# Altium schematic sheet Mynd_Main.SchDoc: Mynd-Main
size A3; PageSetup: Record=PageOptions|CenterHorizontal=True|CenterVertical=True|PrintScale=0.70|XCorrection=1.00|YCorrection=1.00|PrintKind=0|BorderSize=5000000|LeftOffset=0|BottomOffset=0|Orientation=2|PaperLength=1000|PaperWidth=1000|Scale=100|PaperSource=7|PrintQuality=-4|MediaType=1|DitherType=10|PaperKind=A4|PrintScaleMode=1; ApprovedBy: Jianhua.Zhong; CheckedBy: Aileen.zheng; DrawnBy: GuoHui.Lin; Revision: 3.3; SheetNumber: 1; SheetTotal: 6; Model NO.: PS2307; ISSUE DATE: 20230810; REV DATE: 20240117; PCB_Rev: 3.3; ASM_Rev: 3.3
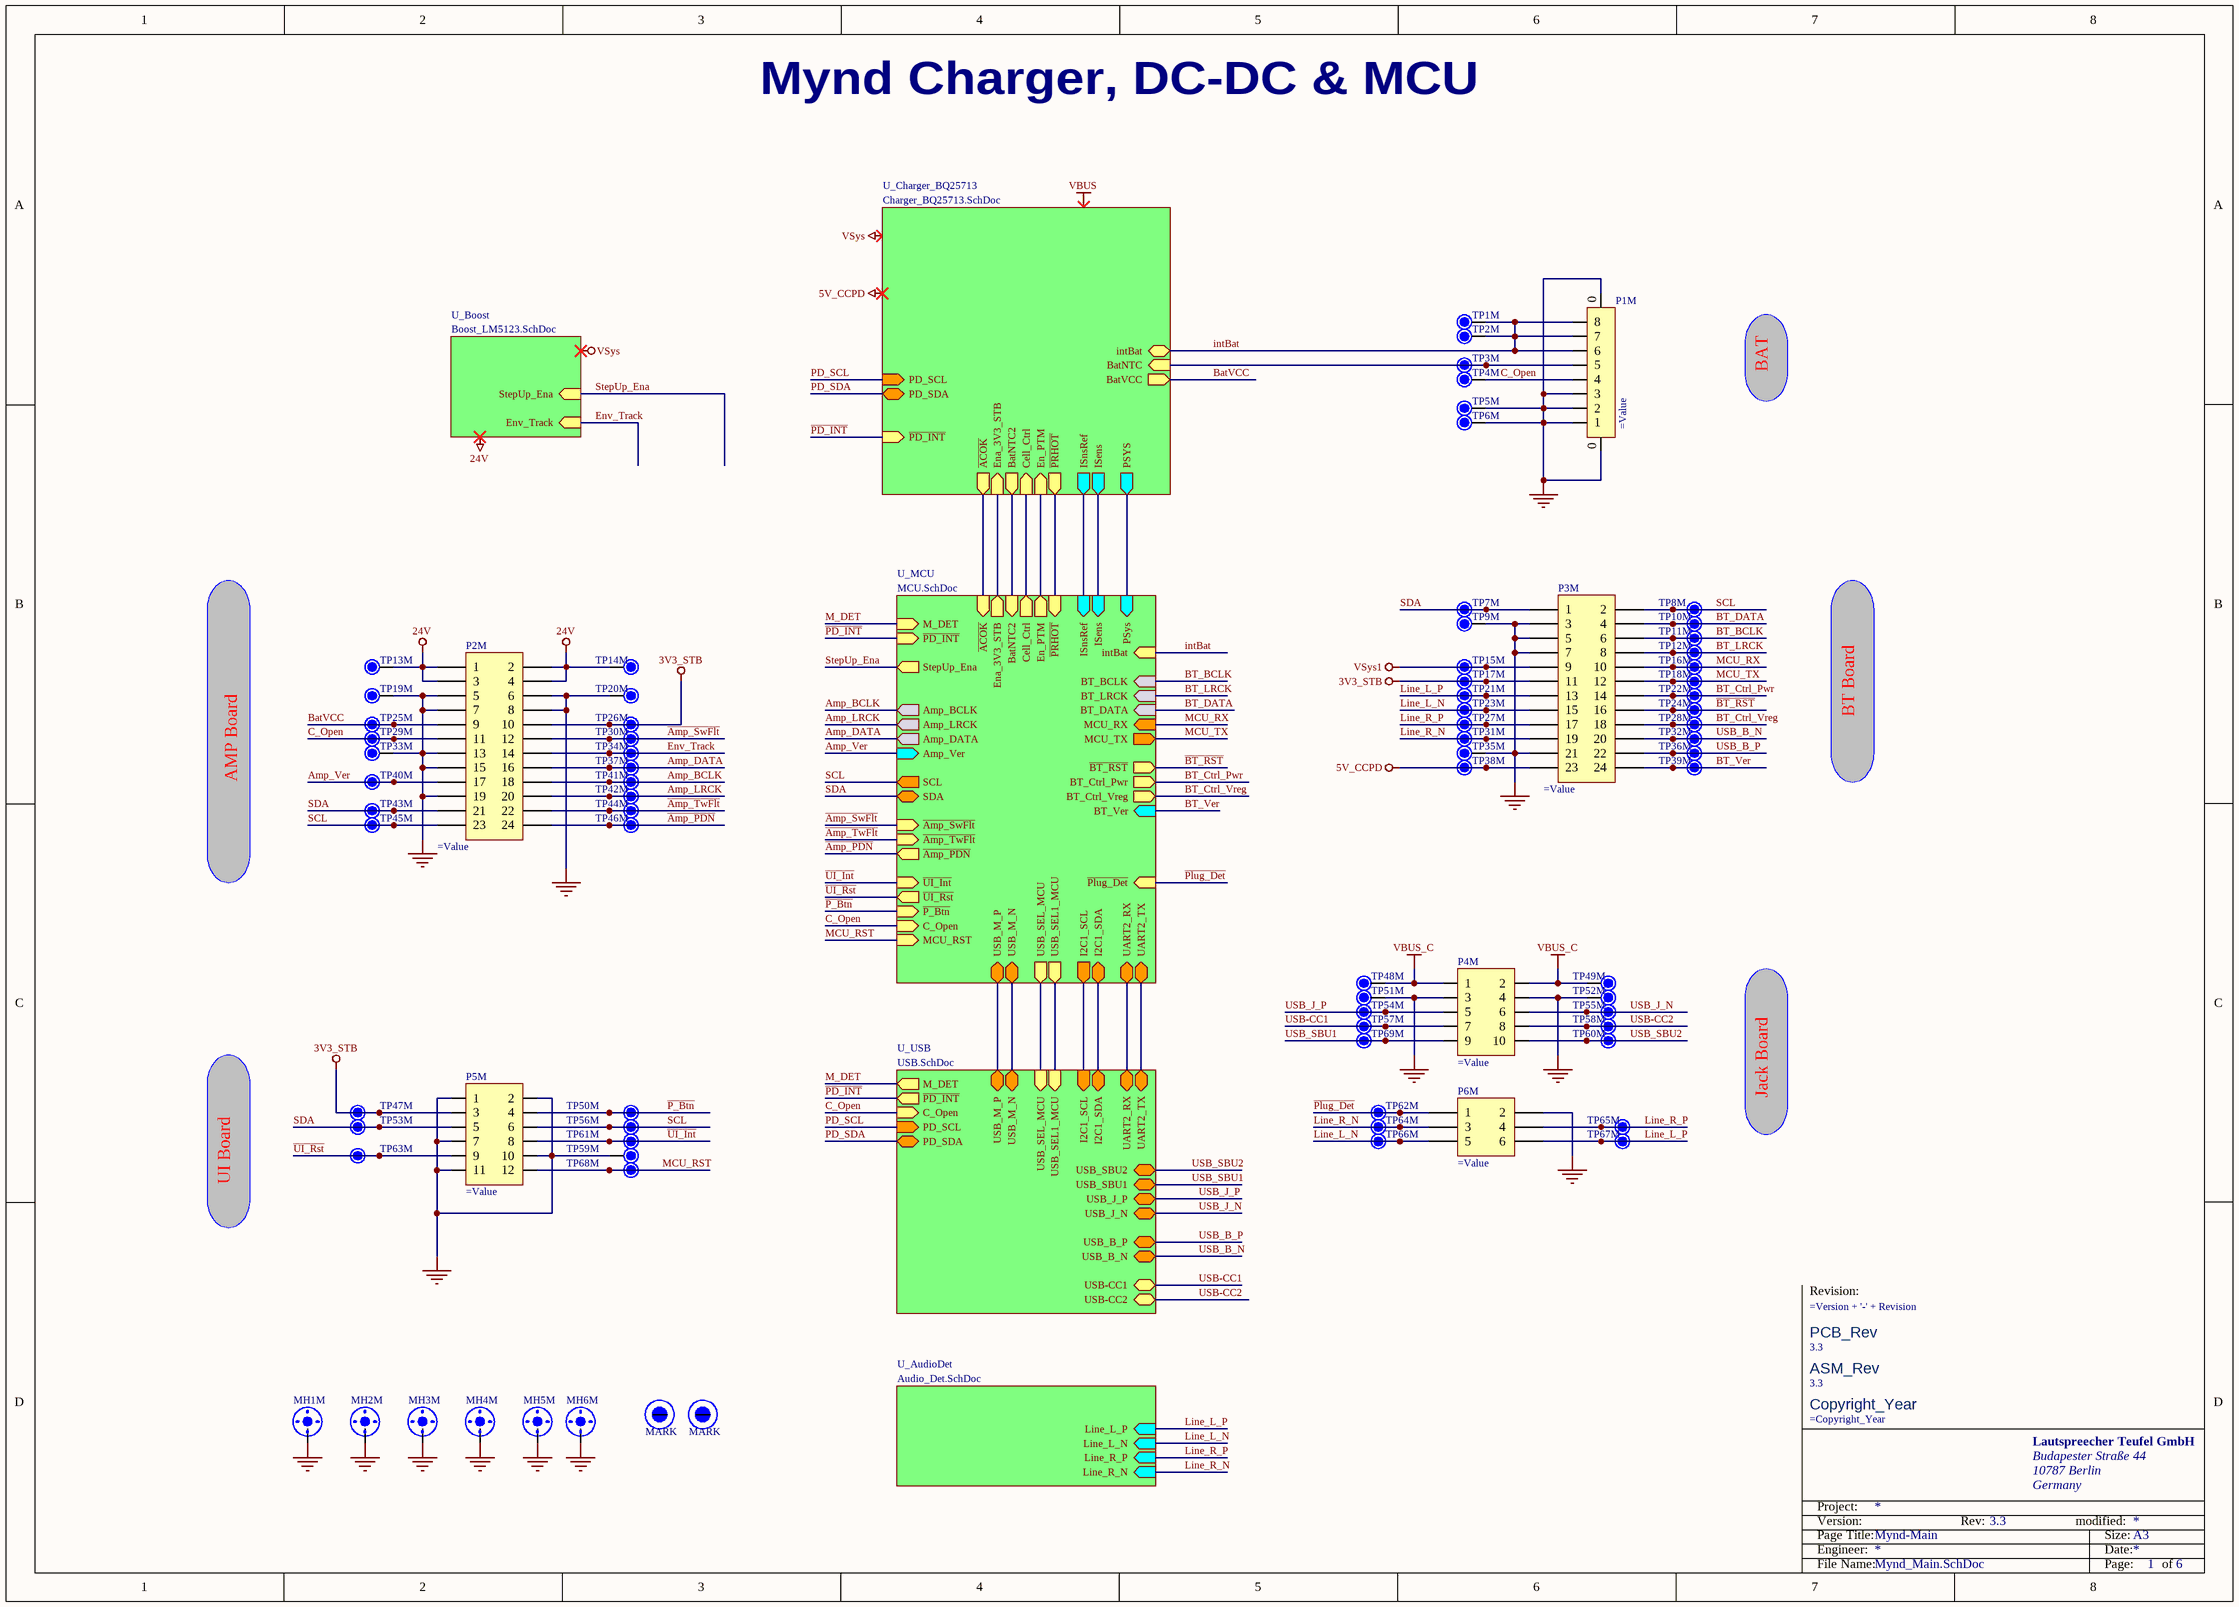
[diagram p0: Mynd_Main.SchDoc]

## Parts
MH1M  SCREW_HOLE_D30  [SCREW_D30]  (value not drawn)  (no BOM)
MH2M  SCREW_HOLE_D30  [SCREW_D30]  (value not drawn)  (no BOM)
MH3M  SCREW_HOLE_D30  [SCREW_D30]  (value not drawn)  (no BOM)
MH4M  SCREW_HOLE_D30  [SCREW_D30]  (value not drawn)  (no BOM)
MH5M  SCREW_HOLE_D30  [SCREW_D30]  (value not drawn)  (no BOM)
MH6M  SCREW_HOLE_D30  [SCREW_D30]  (value not drawn)  (no BOM)
MK1M  MARK  [MARK]  (no BOM)
MK2M  MARK  [MARK]  (no BOM)
P1M  (no value)  [CON_250_SMD_H_8P]
P2M  (no value)  [Female_SMD_Bottom_2X12_254]
P3M  (no value)  [Female_SMD_Bottom_2X12_254]
P4M  (no value)  [WB200AL_2x5P]
P5M  (no value)  [WB200AL_2x6P]
P6M  (no value)  [WB200AL_2x3P]
Teufel_ASM_Label1M  3.3  [Teufel_ASM_Rev]  (no BOM)
Teufel_Copyright1M  (no value)  [TEUFEL_COPYRIGHT]  (no BOM)
Teufel_PCB_Label1M  3.3  [Teufel_PCB_Rev]  (no BOM)
Teufel_PCB_Logo1M  (no value)  [Teufel_NoLogo]  (no BOM)
TP1M  TP12  [TP120]  (value not drawn)  (no BOM)
TP2M  TP12  [TP120]  (value not drawn)  (no BOM)
TP3M  TP12  [TP120]  (value not drawn)  (no BOM)
TP4M  TP12  [TP120]  (value not drawn)  (no BOM)
TP5M  TP12  [TP120]  (value not drawn)  (no BOM)
TP6M  TP12  [TP120]  (value not drawn)  (no BOM)
TP7M  TP12  [TP120]  (value not drawn)  (no BOM)
TP8M  TP12  [TP120]  (value not drawn)  (no BOM)
TP9M  TP12  [TP120]  (value not drawn)  (no BOM)
TP10M  TP12  [TP120]  (value not drawn)  (no BOM)
TP11M  TP12  [TP120]  (value not drawn)  (no BOM)
TP12M  TP12  [TP120]  (value not drawn)  (no BOM)
TP13M  TP12  [TP120]  (value not drawn)  (no BOM)
TP14M  TP12  [TP120]  (value not drawn)  (no BOM)
TP15M  TP12  [TP120]  (value not drawn)  (no BOM)
TP16M  TP12  [TP120]  (value not drawn)  (no BOM)
TP17M  TP12  [TP120]  (value not drawn)  (no BOM)
TP18M  TP12  [TP120]  (value not drawn)  (no BOM)
TP19M  TP12  [TP120]  (value not drawn)  (no BOM)
TP20M  TP12  [TP120]  (value not drawn)  (no BOM)
TP21M  TP12  [TP120]  (value not drawn)  (no BOM)
TP22M  TP12  [TP120]  (value not drawn)  (no BOM)
TP23M  TP12  [TP120]  (value not drawn)  (no BOM)
TP24M  TP12  [TP120]  (value not drawn)  (no BOM)
TP25M  TP12  [TP120]  (value not drawn)  (no BOM)
TP26M  TP12  [TP120]  (value not drawn)  (no BOM)
TP27M  TP12  [TP120]  (value not drawn)  (no BOM)
TP28M  TP12  [TP120]  (value not drawn)  (no BOM)
TP29M  TP12  [TP120]  (value not drawn)  (no BOM)
TP30M  TP12  [TP120]  (value not drawn)  (no BOM)
TP31M  TP12  [TP120]  (value not drawn)  (no BOM)
TP32M  TP12  [TP120]  (value not drawn)  (no BOM)
TP33M  TP12  [TP120]  (value not drawn)  (no BOM)
TP34M  TP12  [TP120]  (value not drawn)  (no BOM)
TP35M  TP12  [TP120]  (value not drawn)  (no BOM)
TP36M  TP12  [TP120]  (value not drawn)  (no BOM)
TP37M  TP12  [TP120]  (value not drawn)  (no BOM)
TP38M  TP12  [TP120]  (value not drawn)  (no BOM)
TP39M  TP12  [TP120]  (value not drawn)  (no BOM)
TP40M  TP12  [TP120]  (value not drawn)  (no BOM)
TP41M  TP12  [TP120]  (value not drawn)  (no BOM)
TP42M  TP12  [TP120]  (value not drawn)  (no BOM)
TP43M  TP12  [TP120]  (value not drawn)  (no BOM)
TP44M  TP12  [TP120]  (value not drawn)  (no BOM)
TP45M  TP12  [TP120]  (value not drawn)  (no BOM)
TP46M  TP12  [TP120]  (value not drawn)  (no BOM)
TP47M  TP12  [TP120]  (value not drawn)  (no BOM)
TP48M  TP12  [TP120]  (value not drawn)  (no BOM)
TP49M  TP12  [TP120]  (value not drawn)  (no BOM)
TP50M  TP12  [TP120]  (value not drawn)  (no BOM)
TP51M  TP12  [TP120]  (value not drawn)  (no BOM)
TP52M  TP12  [TP120]  (value not drawn)  (no BOM)
TP53M  TP12  [TP120]  (value not drawn)  (no BOM)
TP54M  TP12  [TP120]  (value not drawn)  (no BOM)
TP55M  TP12  [TP120]  (value not drawn)  (no BOM)
TP56M  TP12  [TP120]  (value not drawn)  (no BOM)
TP57M  TP12  [TP120]  (value not drawn)  (no BOM)
TP58M  TP12  [TP120]  (value not drawn)  (no BOM)
TP59M  TP12  [TP120]  (value not drawn)  (no BOM)
TP60M  TP12  [TP120]  (value not drawn)  (no BOM)
TP61M  TP12  [TP120]  (value not drawn)  (no BOM)
TP62M  TP12  [TP120]  (value not drawn)  (no BOM)
TP63M  TP12  [TP120]  (value not drawn)  (no BOM)
TP64M  TP12  [TP120]  (value not drawn)  (no BOM)
TP65M  TP12  [TP120]  (value not drawn)  (no BOM)
TP66M  TP12  [TP120]  (value not drawn)  (no BOM)
TP67M  TP12  [TP120]  (value not drawn)  (no BOM)
TP68M  TP12  [TP120]  (value not drawn)  (no BOM)
TP69M  TP12  [TP120]  (value not drawn)  (no BOM)

## Sub-sheets
U_AudioDet = Audio_Det.SchDoc: Line_L_P (in), Line_L_N (in), Line_R_P (in), Line_R_N (in)
U_Boost = Boost_LM5123.SchDoc: Env_Track (in), StepUp_Ena (in)
U_Charger_BQ25713 = Charger_BQ25713.SchDoc: intBat (bidir), ISens (out), ISnsRef (out), Ena_3V3_STB (in), En_PTM (in), Cell_Ctrl (in), ~{PD_INT} (in), BatNTC (in), BatNTC2 (out), PD_SCL (in), PD_SDA (bidir), ~{ACOK} (out), ~{PRHOT} (out), PSYS (out), BatVCC (out)
U_MCU = MCU.SchDoc: ~{ACOK} (in), En_PTM (out), ~{PRHOT} (in), ISnsRef (in), ISens (in), StepUp_Ena (out), ~{Amp_PDN} (out), ~{Amp_TwFlt} (in), Amp_DATA (out), Amp_LRCK (out), Amp_BCLK (out), MCU_RX (in), MCU_TX (out), ~{BT_RST} (out), BT_Ctrl_Pwr (out), BT_Ctrl_Vreg (out), ~{Plug_Det} (in), ~{UI_Int} (in), ~{UI_Rst} (out), ~{P_Btn} (in), ~{PD_INT} (in), SCL (out), SDA (bidir), Ena_3V3_STB (out), I2C1_SCL (out), I2C1_SDA (bidir), USB_M_P (bidir), USB_SEL_MCU (out), USB_M_N (bidir), C_Open (in), Cell_Ctrl (out), ~{Amp_SwFlt} (in), BT_DATA (in), BT_LRCK (in), BT_BCLK (in), BatNTC2 (in), BT_Ver (in), Amp_Ver (in), M_DET (in), PSys (in), MCU_RST (in), USB_SEL1_MCU (out), UART2_RX (bidir), UART2_TX (bidir), intBat (in)
U_USB = USB.SchDoc: I2C1_SCL (in), ~{PD_INT} (out), I2C1_SDA (bidir), USB-CC1 (bidir), USB-CC2 (bidir), USB_J_P (bidir), USB_M_N (bidir), USB_B_N (bidir), USB_J_N (bidir), USB_M_P (bidir), USB_B_P (bidir), USB_SEL_MCU (in), PD_SCL (in), PD_SDA (bidir), M_DET (out), C_Open (in), USB_SEL1_MCU (in), USB_SBU1 (bidir), USB_SBU2 (bidir), UART2_RX (bidir), UART2_TX (bidir)

## Nets
3V3_STB: P2M.10 P3M.11 P5M.3 TP17M.1 TP26M.1 TP47M.1
5V_CCPD: P3M.23 TP38M.1
24V: P2M.1 P2M.2 P2M.3 P2M.4 TP13M.1 TP14M.1
GND: MH1M.1 MH2M.1 MH3M.1 MH4M.1 MH5M.1 MH6M.1 P1M.0 P1M.1 P1M.2 P1M.3 P2M.5 P2M.6 P2M.7 P2M.8 P2M.13 P2M.15 P2M.19 P3M.3 P3M.5 P3M.7 P3M.21 P4M.3 P4M.4 P5M.1 P5M.2 P5M.7 P5M.10 P5M.11 P6M.2 TP5M.1 TP6M.1 TP9M.1 TP19M.1 TP20M.1 TP33M.1 TP35M.1 TP51M.1 TP52M.1 TP59M.1
VBUS_C: P4M.1 P4M.2 TP48M.1 TP49M.1
VSys1: P3M.9 TP15M.1
~{BT_RST}: P3M.16 TP24M.1 ; sheet U_MCU/~{BT_RST}
~{P_Btn}: P5M.4 TP50M.1 ; sheet U_MCU/~{P_Btn}
~{PD_INT}: sheet U_USB/~{PD_INT}, sheet U_MCU/~{PD_INT}, sheet U_Charger_BQ25713/~{PD_INT}
~{Plug_Det}: P6M.1 TP62M.1 ; sheet U_MCU/~{Plug_Det}
~{UI_Int}: P5M.8 TP61M.1 ; sheet U_MCU/~{UI_Int}
~{UI_Rst}: P5M.9 TP63M.1 ; sheet U_MCU/~{UI_Rst}
~{Amp_PDN}: P2M.24 TP46M.1 ; sheet U_MCU/~{Amp_PDN}
~{Amp_SwFlt}: P2M.12 TP30M.1 ; sheet U_MCU/~{Amp_SwFlt}
~{Amp_TwFlt}: P2M.22 TP44M.1 ; sheet U_MCU/~{Amp_TwFlt}
Amp_BCLK: P2M.18 TP41M.1 ; sheet U_MCU/Amp_BCLK
Amp_DATA: P2M.16 TP37M.1 ; sheet U_MCU/Amp_DATA
Amp_LRCK: P2M.20 TP42M.1 ; sheet U_MCU/Amp_LRCK
Amp_Ver: P2M.17 TP40M.1 ; sheet U_MCU/Amp_Ver
BatVCC: P2M.9 TP25M.1 ; sheet U_Charger_BQ25713/BatVCC
BT_BCLK: P3M.6 TP11M.1 ; sheet U_MCU/BT_BCLK
BT_Ctrl_Pwr: P3M.14 TP22M.1 ; sheet U_MCU/BT_Ctrl_Pwr
BT_Ctrl_Vreg: P3M.18 TP28M.1 ; sheet U_MCU/BT_Ctrl_Vreg
BT_DATA: P3M.4 TP10M.1 ; sheet U_MCU/BT_DATA
BT_LRCK: P3M.8 TP12M.1 ; sheet U_MCU/BT_LRCK
BT_Ver: P3M.24 TP39M.1 ; sheet U_MCU/BT_Ver
C_Open: P1M.4 P2M.11 TP4M.1 TP29M.1 ; sheet U_USB/C_Open, sheet U_MCU/C_Open
Env_Track: P2M.14 TP34M.1 ; sheet U_Boost/Env_Track
intBat: P1M.6 P1M.7 P1M.8 TP1M.1 TP2M.1 ; sheet U_MCU/intBat, sheet U_Charger_BQ25713/intBat
Line_L_N: P3M.15 P6M.5 TP23M.1 TP66M.1 ; sheet U_AudioDet/Line_L_N
Line_L_P: P3M.13 P6M.6 TP21M.1 TP67M.1 ; sheet U_AudioDet/Line_L_P
Line_R_N: P3M.19 P6M.3 TP31M.1 TP64M.1 ; sheet U_AudioDet/Line_R_N
Line_R_P: P3M.17 P6M.4 TP27M.1 TP65M.1 ; sheet U_AudioDet/Line_R_P
M_DET: sheet U_USB/M_DET, sheet U_MCU/M_DET
MCU_RST: P5M.12 TP68M.1 ; sheet U_MCU/MCU_RST
MCU_RX: P3M.10 TP16M.1 ; sheet U_MCU/MCU_RX
MCU_TX: P3M.12 TP18M.1 ; sheet U_MCU/MCU_TX
PD_SCL: sheet U_USB/PD_SCL, sheet U_Charger_BQ25713/PD_SCL
PD_SDA: sheet U_USB/PD_SDA, sheet U_Charger_BQ25713/PD_SDA
SCL: P2M.23 P3M.2 P5M.6 TP8M.1 TP45M.1 TP56M.1 ; sheet U_MCU/SCL
SDA: P2M.21 P3M.1 P5M.5 TP7M.1 TP43M.1 TP53M.1 ; sheet U_MCU/SDA
StepUp_Ena: sheet U_MCU/StepUp_Ena, sheet U_Boost/StepUp_Ena
USB-CC1: P4M.7 TP57M.1 ; sheet U_USB/USB-CC1
USB-CC2: P4M.8 TP58M.1 ; sheet U_USB/USB-CC2
USB_B_N: P3M.20 TP32M.1 ; sheet U_USB/USB_B_N
USB_B_P: P3M.22 TP36M.1 ; sheet U_USB/USB_B_P
USB_J_N: P4M.6 TP55M.1 ; sheet U_USB/USB_J_N
USB_J_P: P4M.5 TP54M.1 ; sheet U_USB/USB_J_P
USB_SBU1: P4M.9 TP69M.1 ; sheet U_USB/USB_SBU1
USB_SBU2: P4M.10 TP60M.1 ; sheet U_USB/USB_SBU2
NetP1M_5: P1M.5 TP3M.1 ; sheet U_Charger_BQ25713/BatNTC
(unnamed): sheet U_USB/I2C1_SCL, sheet U_MCU/I2C1_SCL
(unnamed): sheet U_USB/I2C1_SDA, sheet U_MCU/I2C1_SDA
(unnamed): sheet U_USB/USB_M_N, sheet U_MCU/USB_M_N
(unnamed): sheet U_USB/USB_M_P, sheet U_MCU/USB_M_P
(unnamed): sheet U_USB/USB_SEL_MCU, sheet U_MCU/USB_SEL_MCU
(unnamed): sheet U_USB/USB_SEL1_MCU, sheet U_MCU/USB_SEL1_MCU
(unnamed): sheet U_USB/UART2_RX, sheet U_MCU/UART2_RX
(unnamed): sheet U_USB/UART2_TX, sheet U_MCU/UART2_TX
(unnamed): sheet U_MCU/~{ACOK}, sheet U_Charger_BQ25713/~{ACOK}
(unnamed): sheet U_MCU/En_PTM, sheet U_Charger_BQ25713/En_PTM
(unnamed): sheet U_MCU/~{PRHOT}, sheet U_Charger_BQ25713/~{PRHOT}
(unnamed): sheet U_MCU/ISnsRef, sheet U_Charger_BQ25713/ISnsRef
(unnamed): sheet U_MCU/ISens, sheet U_Charger_BQ25713/ISens
(unnamed): sheet U_MCU/Ena_3V3_STB, sheet U_Charger_BQ25713/Ena_3V3_STB
(unnamed): sheet U_MCU/Cell_Ctrl, sheet U_Charger_BQ25713/Cell_Ctrl
(unnamed): sheet U_MCU/BatNTC2, sheet U_Charger_BQ25713/BatNTC2
(unnamed): sheet U_MCU/PSys, sheet U_Charger_BQ25713/PSYS

Not connected (* = marked no-connect by the designer): MK1M MK_B MK_T; MK2M MK_B MK_T

## Notes on the sheet
- Mynd Charger, DC-DC & MCU
- BAT
- BT Board
- AMP Board
- Jack Board
- UI Board
- Labels drawn without touching a wire or pin: 5V_CCPD, 24V, VBUS, VSys
- Revision:
- Lautspreecher Teufel GmbH
- Budapester Straße 44
- 10787 Berlin
- Germany
- Page Title:
- Engineer:
- Project:
- Version:
- Rev:
- modified:
- Date:
- Size:
- A3
- File Name:
- Page:
- of
- (in symbol CMP-00086-3) Copyright_Year
- (in symbol CMP-00087-3) PCB_Rev
- (in symbol CMP-00088-2) ASM_Rev

## Library data of the parts
MH1M MH2M MH3M MH4M MH5M MH6M = N-001-00011-1
MK1M MK2M = N-001-00003-2: MARK DOT; Design Item ID: MARK
P1M = C-001-1108-2: SMD WTB CONNECTOR 8P P2.5mm TIN; Part_Type: Connector SMT; Value: WT250MW-084R-0W; System: Connector; Part_Number: WT250MW-084R-0W
P2M P3M = C-001-1097-2: SMD BTB CONNECTOR 24P P2.54mm GOLD; Manufacturer: MINGHENG; Part_Type: Connector SMT; Value: 2.54FH 2x12Pin H3.55 SMT; System: Connector; Part_Number: 2.54FH 2x12Pin H3.55 SMT
P4M = C-001-1143-2: SMD WTB CONNECTOR 10P P2.0mm TIN; Manufacturer: MINGHENG; Part_Type: Connector SMT; Value: WB200AL-10; System: Connector; Part_Number: WB200AL-10
P5M = C-001-1264-2: SMD WTB CONNECTOR 12P P2.0mm TIN; Manufacturer: MINGHENG; Part_Type: Connector SMT; Value: WB200AL-12; System: Connector; Part_Number: WB200AL-12
P6M = C-001-1142-3: SMD WTB CONNECTOR 6P P2.0mm TIN; Manufacturer: MINGHENG; Part_Type: Connector SMT; Value: WB200AL-06; System: Connector; Part_Number: WB200AL-06
Teufel_ASM_Label1M = CMP-00088-2: Teufel_ASM_Rev
Teufel_Copyright1M = CMP-00086-3: Teufel_Copyright_Year
Teufel_PCB_Label1M = CMP-00087-3: Teufel_PCB_Label
Teufel_PCB_Logo1M = Teufel NoLogo: Teufel PCB NoLogo
TP1M TP2M TP3M TP4M TP5M TP6M TP7M TP8M TP9M TP10M TP11M TP12M TP13M TP14M TP15M TP16M TP17M TP18M TP19M TP20M TP21M TP22M TP23M TP24M TP25M TP26M TP27M TP28M TP29M TP30M TP31M TP32M TP33M TP34M TP35M TP36M TP37M TP38M TP39M TP40M TP41M TP42M TP43M TP44M TP45M TP46M TP47M TP48M TP49M TP50M TP51M TP52M TP53M TP54M TP55M TP56M TP57M TP58M TP59M TP60M TP61M TP62M TP63M TP64M TP65M TP66M TP67M TP68M TP69M = N-001-00010-2: Test Point; Design Item ID: TP